# Altium schematic sheet Supply.SchDoc
size A4; SheetNumber: 5; SheetTotal: 6
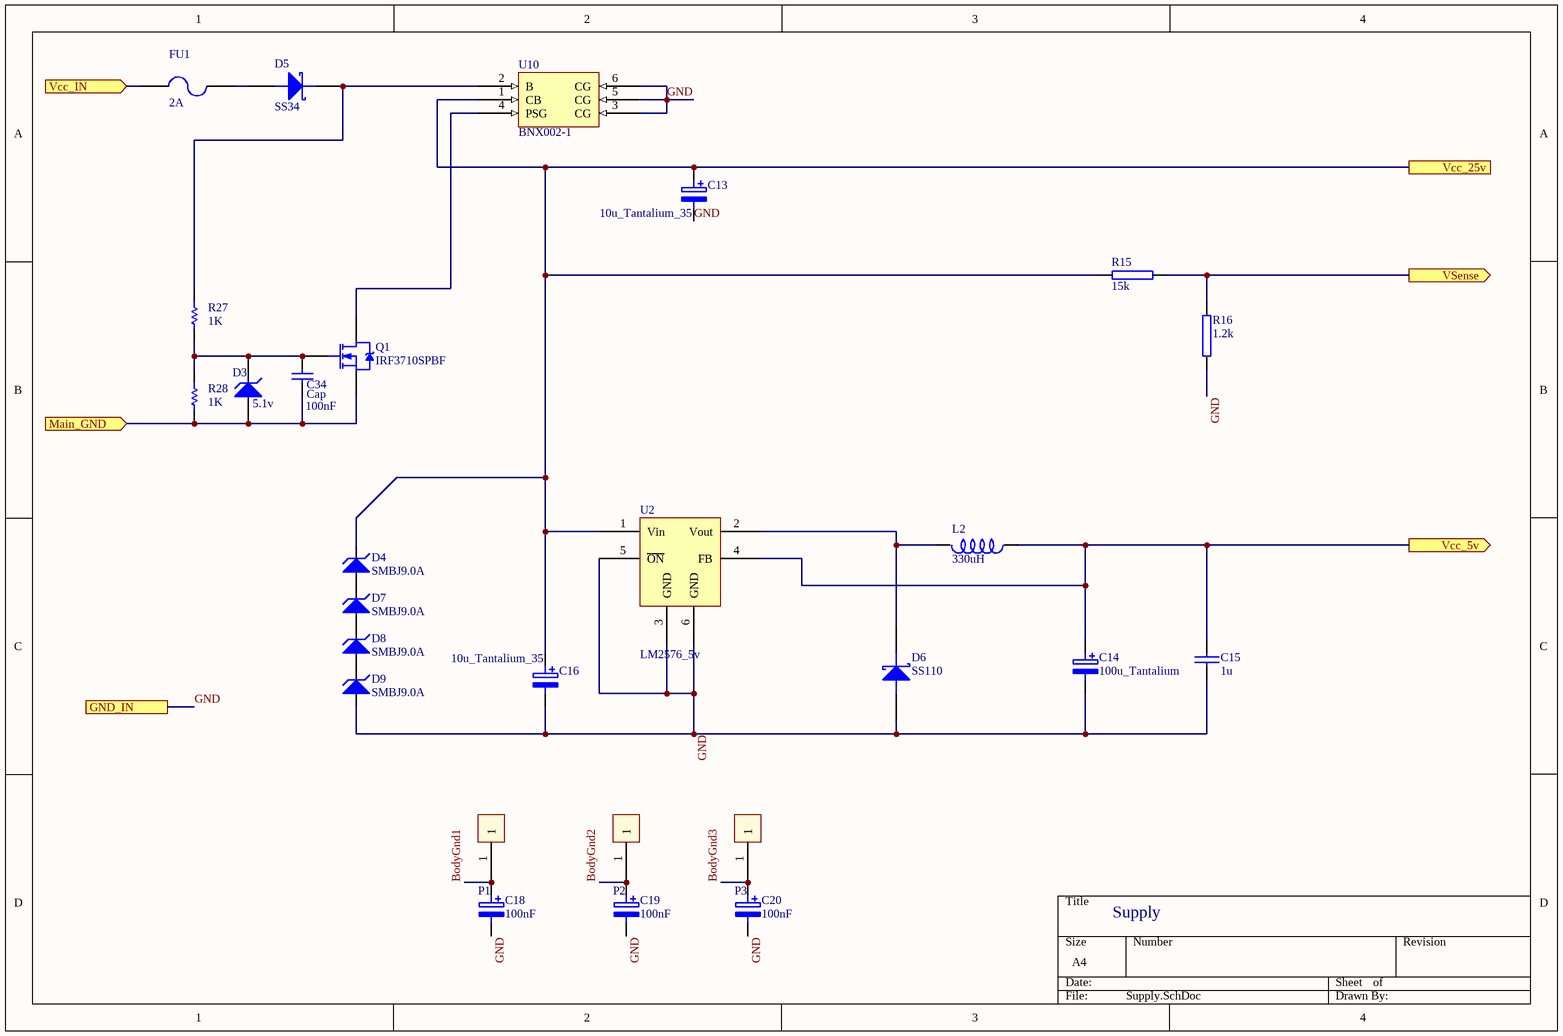
[diagram p0: Supply.SchDoc]

## Parts
C13  10u_Tantalium_35  [Tantalum_9545]
C14  100u_Tantalium  [Tantalum_9545]
C15  1u  [0805]
C16  10u_Tantalium_35  [Tantalum_9545]
C18  100nF  [1206_SMD]
C19  100nF  [1206_SMD]
C20  100nF  [1206_SMD]
C34  Cap  value 100nF  [1206_SMD]
D3  5.1v  [diode zener_smd]
D4  SMBJ9.0A  [SMB]
D5  SS34  [SMC]
D6  SS110  [SMA]
D7  SMBJ9.0A  [SMB]
D8  SMBJ9.0A  [SMB]
D9  SMBJ9.0A  [SMB]
FU1  2A  [7227]
L2  330uH  [inductor_12.3*12.3]
P1  head1  [PAD]  (value not drawn)
P2  head1  [PAD]  (value not drawn)
P3  head1  [PAD]  (value not drawn)
Q1  IRF3710SPBF  [D2PAK]
R15  15k  [1206_SMD]
R16  1.2k  [1206_SMD]
R27  value 1K  [0805_smd]  (hidden comment: Res1)
R28  value 1K  [0805]  (hidden comment: Res1)
U2  LM2576_5v  [TO263-5L]
U10  BNX002-1  [BNX002-1]

## Ports
GND_IN, Main_GND (in), Vcc_5v (out), Vcc_25v, Vcc_IN (in), VSense (out)

## Nets
BodyGnd1: C18.1 P1.1
BodyGnd2: C19.1 P2.1
BodyGnd3: C20.1 P3.1
GND: C13.2 C14.2 C15.2 C16.2 C18.2 C19.2 C20.2 D6.A D9.A R16.1 U2.3(GND) U2.5(~{ON}) U2.6(GND) U10.3(CG) U10.5(CG) U10.6(CG) ; port GND_IN
Main_GND: C34.1 D3.1(A) Q1.3(S) R28.1 ; port Main_GND
Vcc_5v: C14.1 C15.1 L2.1 U2.4(FB) ; port Vcc_5v
Vcc_25v: C13.1 C16.1 D4.K R15.2 U2.1(Vin) U10.1(CB) ; port Vcc_25v
Vcc_IN: FU1.1 ; port Vcc_IN
VSense: R15.1 R16.2 ; port VSense
NetC34_2: C34.2 D3.2(K) Q1.1(G) R27.1 R28.2
NetD4_A: D4.A D7.K
NetD5_A: D5.A FU1.2
NetD5_K: D5.K R27.2 U10.2(B)
NetD6_K: D6.K L2.2 U2.2(Vout)
NetD7_A: D7.A D8.K
NetD8_A: D8.A D9.K
NetQ1_2: Q1.2(D) U10.4(PSG)

## Notes on the sheet
- Supply

## Library data of the parts
C13 C14 C16 C18-C20 = CAP_ELECTRO
C15 = CAP: Capacitor
C34 = Cap: Capacitor; Published: 8-Jun-2000; LatestRevisionDate: 17-Jul-2002; LatestRevisionNote: Re-released for DXP Platform.; PackageReference: RAD-0.3; Publisher: Altium Limited; PackageDescription: Radial Cap, Thru-Hole; 2 Leads; 0.3 in Pin Spacing
D3 = D Zener: Zener Diode; pin to pad: 1>A 2>K; Published: 8-Jun-2000; LatestRevisionDate: 17-Jul-2002; LatestRevisionNote: Re-released for DXP Platform.; PackageReference: DIODE-0.7; Publisher: Altium Limited; PackageDescription: Diode, Thru-Hole; 2 Leads; 0.7 in Pin Spacing
D4 D7-D9 = ZENER: pin to pad: A>1 K>2
D5 = DIODE_SCH: pin to pad: A>1 K>2
D6 = DIODE_SCH
FU1 = FUSE2: Fuse
L2 = INDUCTOR
Q1 = NMOS-2: N-Channel Power MOSFET; Note: Pin 2 is electrically connected to pin 4.; Published: 8-Jun-2000; LatestRevisionDate: 17-Jul-2002; LatestRevisionNote: Re-released for DXP Platform.; DatasheetVersion: PD-9.814; PackageVersion: Feb-1997; PackageReference: TO-220AB; Publisher: Altium Limited; PackageDescription: TO, Thru-Hole, Vertical, Heatsink Mounted; 3 In-Line Leads; Pitch 2.54 mm; ComponentLink1Description: Manufacturer Link; ComponentLink1URL: http://www.irf.com/
R15 R16 = RES2
R27 R28 = Res1: Resistor; Published: 8-Jun-2000; LatestRevisionDate: 17-Jul-2002; LatestRevisionNote: Re-released for DXP Platform.; PackageReference: AXIAL-0.3; Publisher: Altium Limited; PackageDescription: Axial Device, Thru-Hole; 2 Leads; 0.3 in Pin Spacing
U10 = BNX002-1: EMI FILTERS